# Altium schematic sheet analog_outputs_blk.SchDoc
size A4; Engineer: JBayalas; DocumentNumber: 8; Revision: V2.0; SheetNumber: 8; SheetTotal: 11
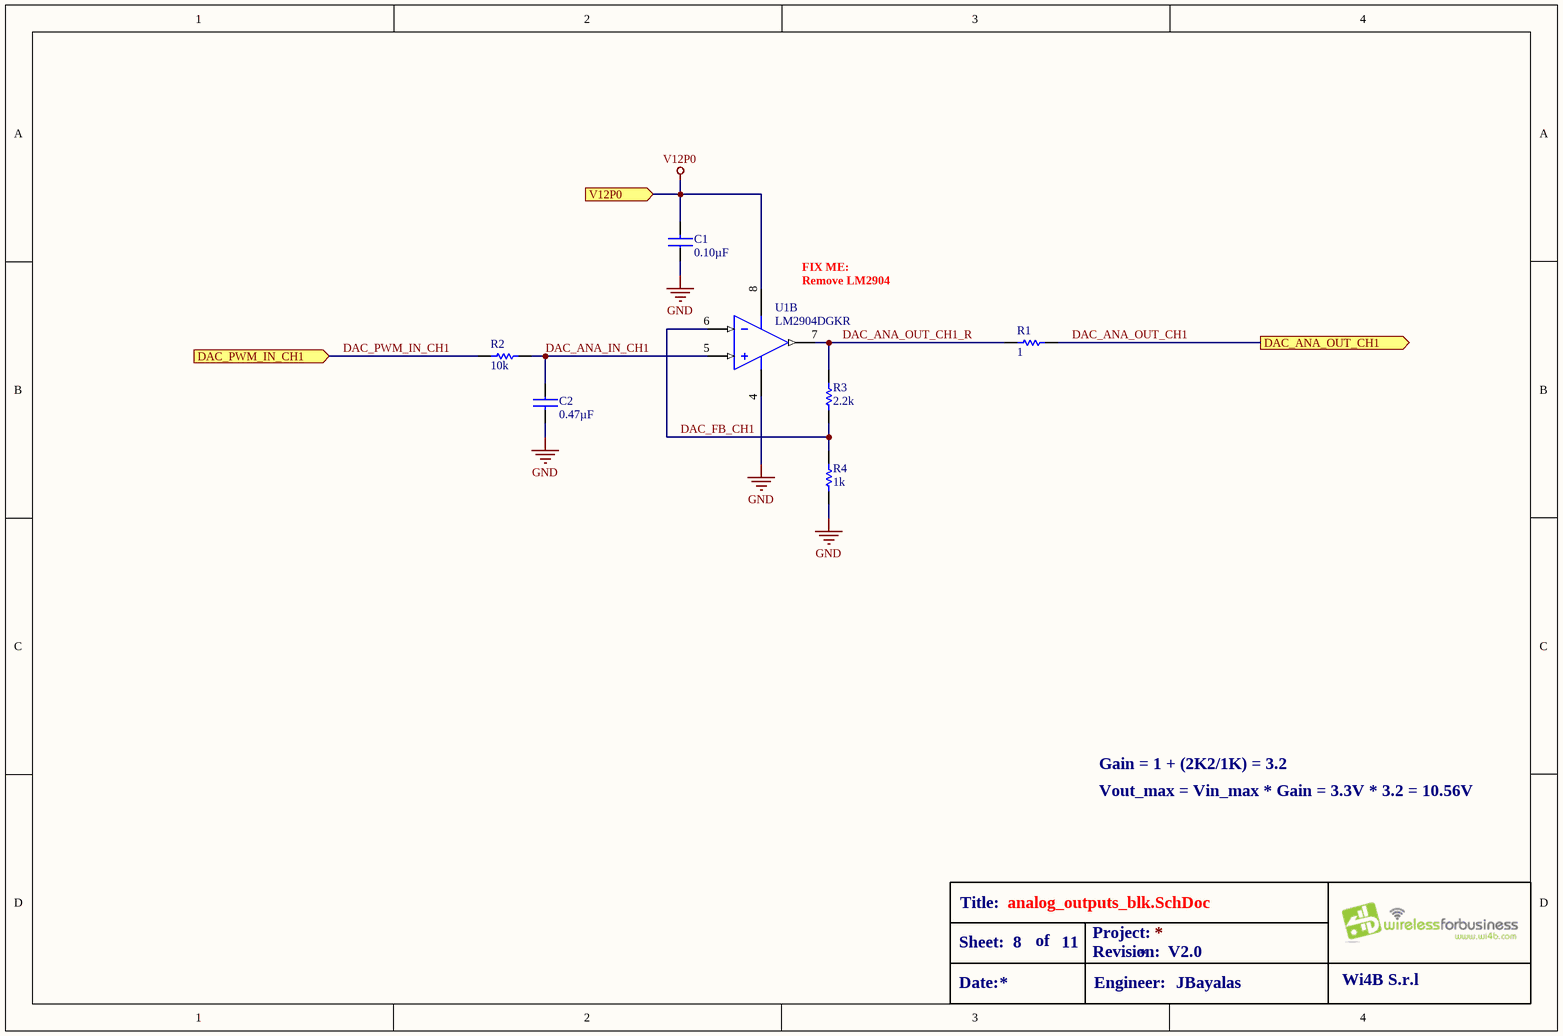
[diagram p0: analog_outputs_blk.SchDoc]

## Parts
C1  value 0.10µF  [C0402]  (hidden comment: GRM155R71H104ME14D)
C2  value 0.47µF  [C0603]  (hidden comment: GRM188R71C474KA88D)
R1  value 1  [R0402]  (hidden comment: CRCW04021R00FKED)
R2  value 10k  [R0402]  (hidden comment: MCS04020C1002FE000)
R3  Resistance (Ohms): 2.2k  [R0603]  (hidden comment: CRCW06032K20FKEA)
R4  value 1k  [R0402]  (hidden comment: MCS04020C1001FE000)
U1  LM2904DGKR  [MSOP-8]  (part B of 2)

## Ports
DAC_ANA_OUT_CH1 (out), DAC_PWM_IN_CH1 (in), V12P0 (in)

## Nets
GND: C1.1 C2.2 R4.1 U1.4
V12P0: C1.2 U1.8 ; port V12P0
DAC_ANA_IN_CH1: C2.1 R2.2 U1.5
DAC_ANA_OUT_CH1: R1.2 ; port DAC_ANA_OUT_CH1
DAC_ANA_OUT_CH1_R: R1.1 R3.2 U1.7
DAC_FB_CH1: R3.1 R4.2 U1.6
DAC_PWM_IN_CH1: R2.1 ; port DAC_PWM_IN_CH1

## Notes on the sheet
- (near U1) FIX ME:
- (near U1) Remove LM2904
- Gain = 1 + (2K2/1K) = 3.2
- Vout_max = Vin_max * Gain = 3.3V * 3.2 = 10.56V
- Title:
- Sheet:
- Date:
- of
- Project:
- Revision:
- Engineer:
- Wi4B S.r.l

## Library data of the parts
C1 = GRM155R71H104ME14D: CAP CER 0.1UF 50V X7R 0402; MFT: Murata Electronics North America; TYPE: SMD; FUNCTION: analog outputs; MPN: GRM155R71H104ME14D; RATING: 50V; DNP: *
C2 = GRM188R71C474KA88D: CAP CER 0.47UF 16V X7R 0603; MFT: Murata Electronics North America; TYPE: SMD; FUNCTION: analog outputs; MPN: GRM188R71C474KA88D; RATING: 16V; DNP: *
R1 = CRCW04021R00FKED: RES SMD 1 OHM 1% 1/16W 0402; MFT: Vishay Dale; FUNCTION: analog outputs; MPN: CRCW04021R00FKED; TYPE: SMD; RATING: 1/16W; DNP: *
R2 = MCS04020C1002FE000: RES SMD 10K OHM 1% 1/10W 0402; MFT: Vishay Beyschlag; FUNCTION: analog outputs; MPN: MCS04020C1002FE000; TYPE: SMD; RATING: 1/10W; DNP: *
R3 = CRCW06032K20FKEA: RES SMD 2.2K OHM 1% 1/10W 0603; Manufacturer: Vishay Dale; Power (Watts): 0.1W, 1/10W; Temperature Coefficient: ±100ppm/°C; FUNCTION: analog outputs; Supplier 1: Digi-Key; Manufacturer Part Number: CRCW06032K20FKEA; RoHS: RoHS Compliant; Category: Resistors; Stock 1: 257334; Pricing 1: 10=0.081, 50=0.0436, 200=0.0251, 1000=0.01711 (USD); Packaging: Digi-Reel®; Tolerance: ±1%; Composition: Thick Film; Features: Automotive AEC-Q200; Operating Temperature: -55°C ~ 155°C; Package / Case: 0603 (1608 Metric); Supplier Device Package: 0603 (1608 Metric); Size / Dimension: 0.061" L x 0.033" W (1.55mm x 0.85mm); Height: 0.020" (0.50mm); Number of Terminations: 2; ComponentLink1URL: http://www.vishay.com/docs/20035/dcrcwe3.pdf; ComponentLink1Description: http://www.vishay.com/docs/20035/dcrcwe3.pdf; Supplier Part Number 1: 541-2.20KHDKR-ND
R4 = MCS04020C1001FE000: RES SMD 1K OHM 1% 1/10W 0402; MFT: Vishay Beyschlag; FUNCTION: analog outputs; MPN: MCS04020C1001FE000; TYPE: SMD; RATING: 1/10W; DNP: *
U1 = LM2904DGKR: IC OPAMP GP 1.1MHZ 8SO; MFT: Rohm Semiconductor; FUNCTION: analog outputs; TYPE: Surface Mount; VALUE: LM2904DGKR; MPN: LM2904DGKR